# Altium schematic sheet MainDesign.SchDoc
size A2
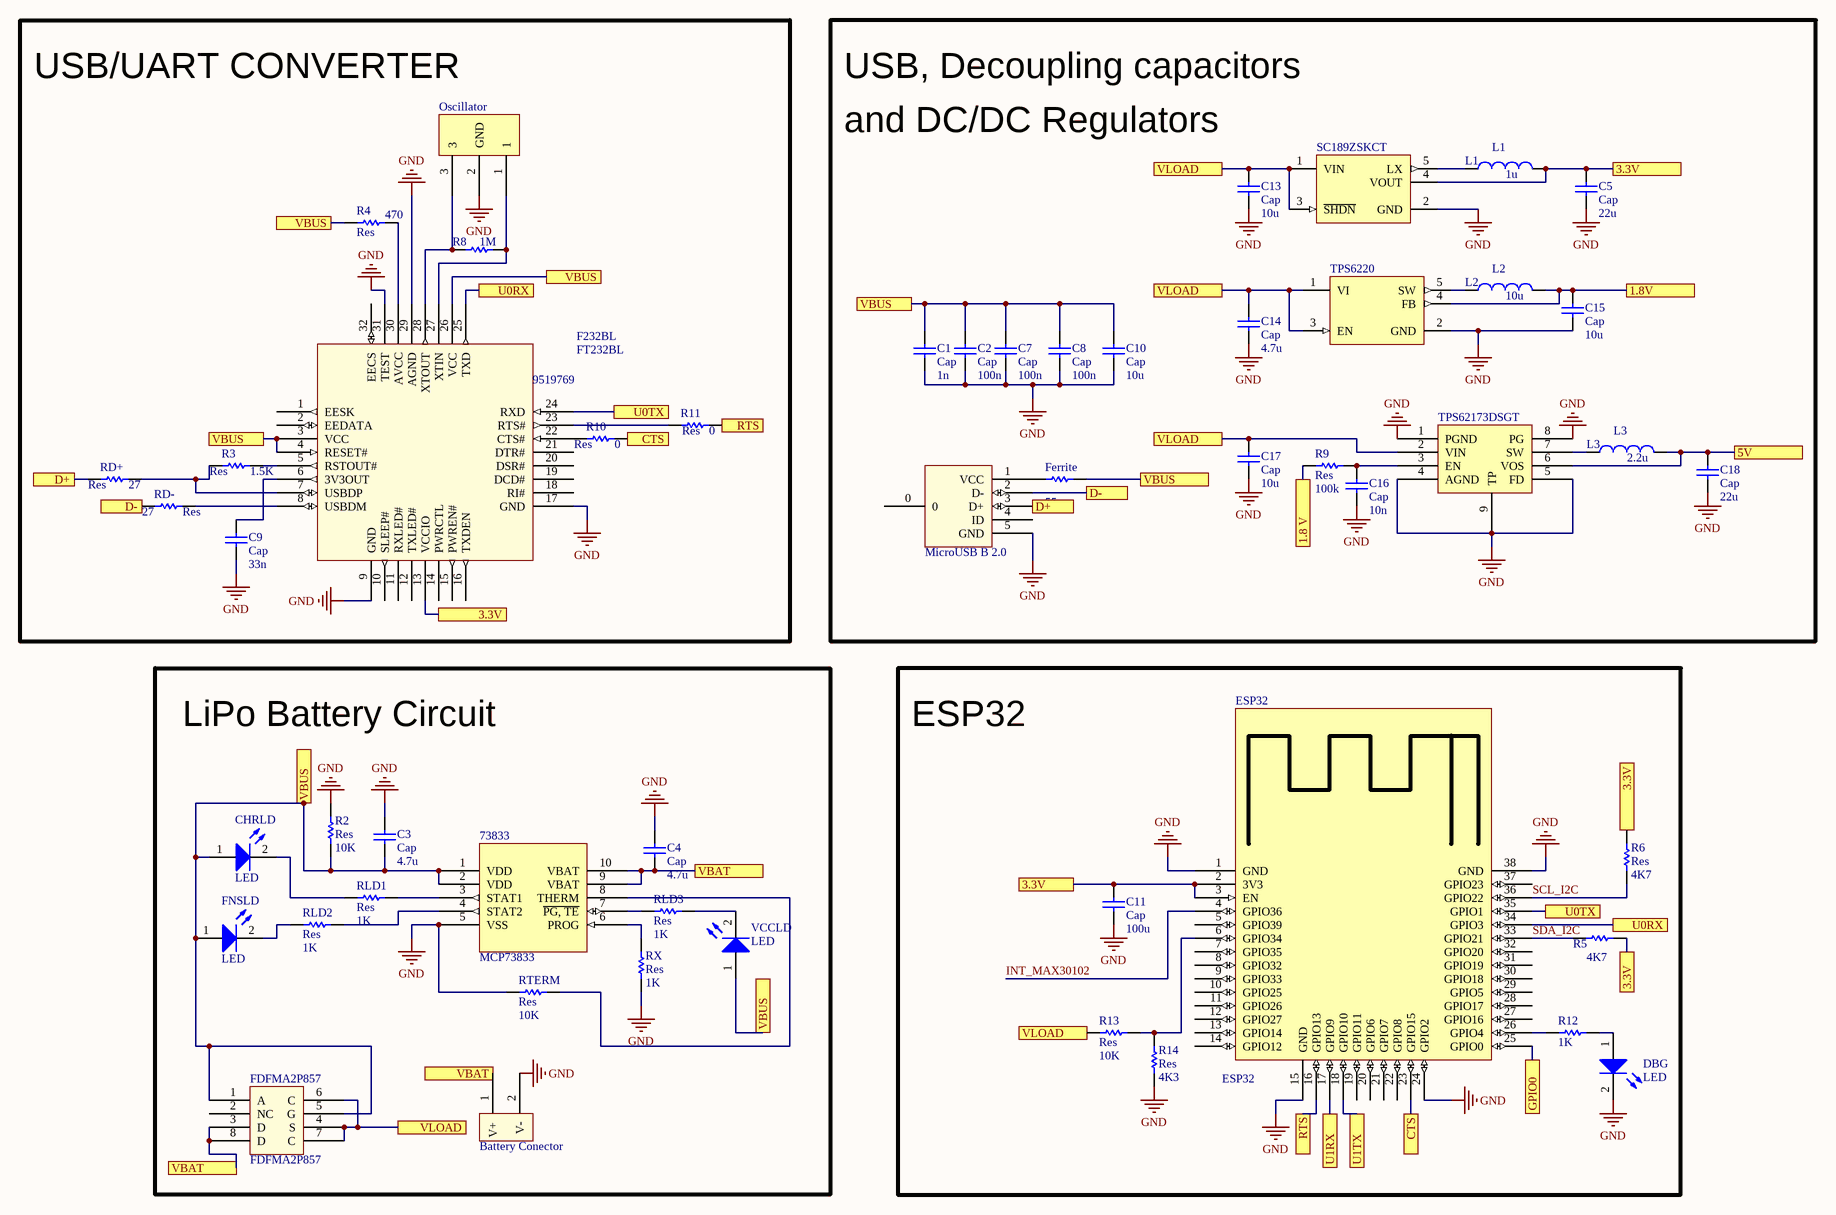
[diagram p0: MainDesign.SchDoc]

## Parts
73833  MCP73833  [MCP73833/4]
Battery_Conector  AMPHENOL 10114830 - Conector de Cable a Placa - 1.25mm  [AMPHENOL 10114830 - Conector de cable a placa - 1.25mm]  (value not drawn)
C1  Cap  value 1n  [0603 Cap]
C2  Cap  value 100n  [0603 Cap]
C3  Cap  value 4.7u  [0603 Cap]
C4  Cap  value 4.7u  [0603 Cap]
C5  Cap  value 22u  [0603 Cap]
C7  Cap  value 100n  [0603 Cap]
C8  Cap  value 100n  [0603 Cap]
C9  Cap  value 33n  [0603 Cap]
C10  Cap  value 10u  [0603 Cap]
C11  Cap  value 100u  [0603 Cap]
C13  Cap  value 10u  [0603 Cap]
C14  Cap  value 4.7u  [0603 Cap]
C15  Cap  value 10u  [0603 Cap]
C16  Cap  value 10n  [0603 Cap]
C17  Cap  value 10u  [0603 Cap]
C18  Cap  value 22u  [0603 Cap]
CHRLD  LED  [0603 LED-BLUE]
DBG  LED  [0603 LED-BLUE]
ESP32  ESP32  [ESP32]
F232BL  FT232BL  Supplier Part Number 1: 9519769  [FT232BQ2]
FDFMA2P857  FDFMA2P857  [FDFMA2P857]
Ferrite  value 55m  [0603 Res]  (hidden comment: Res)
FNSLD  LED  [0603 LED-BLUE]
L1  L1  value 1u  [0603 IND]
L2  L2  value 10u  [0603 IND]
L3  L3  value 2.2u  [0603 IND]
MicroUSB_B_2.0  MicroUSB B 2.0  [USB-MicroB]
Oscillator  CSTCRM600G55  [CSCTCR6M00G55B]  (value not drawn)
R2  Res  value 10K  [0603 Res]
R3  Res  value 1.5K  [0603 Res]
R4  Res  value 470  [0603 Res]
R5  value 4K7  [0603 Res]  (hidden comment: Res)
R6  Res  value 4K7  [0603 Res]
R8  value 1M  [0603 Res]  (hidden comment: Res)
R9  Res  value 100k  [0603 Res]
R10  Res  value 0  [0603 Res]
R11  Res  value 0  [0603 Res]
R12  value 1K  [0603 Res]  (hidden comment: Res)
R13  Res  value 10K  [0603 Res]
R14  Res  value 4K3  [0603 Res]
RD+  Res  value 27  [0603 Res]
RD-  Res  value 27  [0603 Res]
RLD1  Res  value 1K  [0603 Res]
RLD2  Res  value 1K  [0603 Res]
RLD3  Res  value 1K  [0603 Res]
RTERM  Res  value 10K  [0603 Res]
RX  Res  value 1K  [0603 Res]
SC189ZSKCT  SC189ZSKCT  [SOT23-5]  (value not drawn)
TPS6220  TPS6220  [SOT23-5]  (value not drawn)
TPS62173DSGT  TPS62173DSGT  [TPS62173DSGT]  (value not drawn)
VCCLD  LED  [0603 LED-BLUE]

## Blocks framed on the sheet
USB/UART CONVERTER: C9 F232BL Oscillator R3 R4 R8 R10 R11 RD+ RD-
LiPo Battery Circuit: 73833 Battery_Conector C3 C4 CHRLD FDFMA2P857 FNSLD R2 RLD1-RLD3 RTERM RX VCCLD
ESP32: C11 DBG ESP32 R5 R6 R12-R14

## Ports
1.8 V, 1.8V, 3.3V, 5V, CTS, D+, D-, GPIO0, RTS, U0RX, U0TX, U1RX, U1TX, VBAT, VBUS, VLOAD

## Nets
GND: 73833.5(VSS) Battery_Conector.2(V-) C1.1 C2.1 C3.2 C4.2 C5.1 C7.2 C8.1 C9.1 C10.2 C11.1 C13.1 C14.1 C15.1 C16.1 C17.2 C18.1 DBG.2(C) ESP32.1(GND) ESP32.15(GND) ESP32.24(GPIO2) ESP32.38(GND) F232BL.9(GND) F232BL.17(GND) F232BL.29(AGND) F232BL.31(TEST) MicroUSB_B_2.0.5(GND) Oscillator.2(GND) R2.2 R14.2 RTERM.1 RX.2 SC189ZSKCT.2(GND) TPS6220.2(GND) TPS62173DSGT.1(PGND) TPS62173DSGT.4(AGND) TPS62173DSGT.5(FD) TPS62173DSGT.8(PG) TPS62173DSGT.9(TP)
1.8 V: R9.2 ; port 1.8 V
1.8V: C15.2 L2.2 TPS6220.4(FB) ; port 1.8V
3.3V: C5.2 C11.2 ESP32.2(3V3) ESP32.3(EN) F232BL.13(VCCIO) L1.2 R5.1 R6.1 SC189ZSKCT.4(VOUT) ; port 3.3V
5V: C18.2 L3.2 TPS62173DSGT.6(VOS) ; port 5V
CTS: ESP32.23(GPIO15) R10.1 ; port CTS
D+: MicroUSB_B_2.0.3(D+) RD+.1 ; port D+
D-: MicroUSB_B_2.0.2(D-) RD-.1 ; port D-
GPIO0: ESP32.25(GPIO0) ; port GPIO0
INT_MAX30102: ESP32.4(GPIO36)
RTS: ESP32.16(GPIO13) R11.1 ; port RTS
SCL_I2C: ESP32.36(GPIO22) R6.2
SDA_I2C: ESP32.33(GPIO21) R5.2
U0RX: ESP32.34(GPIO3) F232BL.25(TXD) ; port U0RX
U0TX: ESP32.35(GPIO1) F232BL.24(RXD) ; port U0TX
U1RX: ESP32.17(GPIO9) ; port U1RX
U1TX: ESP32.18(GPIO10) ; port U1TX
VBAT: 73833.9(VBAT) 73833.10(VBAT) Battery_Conector.1(V+) C4.1 FDFMA2P857.3(D) FDFMA2P857.8(D) ; port VBAT
VBUS: 73833.1(VDD) 73833.2(VDD) C1.2 C2.2 C3.1 C7.1 C8.2 C10.1 CHRLD.1(A) F232BL.3(VCC) F232BL.4(RESET#) F232BL.26(VCC) FDFMA2P857.1(A) FDFMA2P857.5(G) Ferrite.2 FNSLD.1(A) R2.1 R4.1 VCCLD.1(A) ; port VBUS
VLOAD: C13.2 C14.2 C17.1 FDFMA2P857.4(S) FDFMA2P857.6(C) FDFMA2P857.7(C) R13.1 SC189ZSKCT.1(VIN) SC189ZSKCT.3(~{SHDN}) TPS6220.1(VI) TPS6220.3(EN) TPS62173DSGT.2(VIN) ; port VLOAD
Net73833_3: 73833.3(STAT1) RLD1.1
Net73833_4: 73833.4(STAT2) RLD2.1
Net73833_6: 73833.6(PROG) RX.1
Net73833_7: 73833.7(~{PG,_TE}) RLD3.2
Net73833_8: 73833.8(THERM) RTERM.2
NetC9_2: C9.2 F232BL.6(3V3OUT)
NetC16_2: C16.2 R9.1 TPS62173DSGT.3(EN)
NetCHRLD_2: CHRLD.2(C) RLD1.2
NetDBG_1: DBG.1(A) R12.2
NetESP32_6: ESP32.6(GPIO34) R13.2 R14.1
NetESP32_26: ESP32.26(GPIO4) R12.1
NetF232BL_5: F232BL.5(RSTOUT#) R3.2
NetF232BL_7: F232BL.7(USBDP) R3.1 RD+.2
NetF232BL_8: F232BL.8(USBDM) RD-.2
NetF232BL_22: F232BL.22(CTS#) R10.2
NetF232BL_23: F232BL.23(RTS#) R11.2
NetF232BL_27: F232BL.27(XTIN) Oscillator.1 R8.2
NetF232BL_28: F232BL.28(XTOUT) Oscillator.3 R8.1
NetF232BL_30: F232BL.30(AVCC) R4.2
NetFerrite_1: Ferrite.1 MicroUSB_B_2.0.1(VCC)
NetFNSLD_2: FNSLD.2(C) RLD2.2
NetL1_1: L1.1 SC189ZSKCT.5(LX)
NetL2_1: L2.1 TPS6220.5(SW)
NetL3_1: L3.1 TPS62173DSGT.7(SW)
NetRLD3_1: RLD3.1 VCCLD.2(C)

Not connected (* = marked no-connect by the designer): ESP32 5(GPIO39) 7(GPIO35) 8(GPIO32) 9(GPIO33) 10(GPIO25) 11(GPIO26) 12(GPIO27) 13(GPIO14) 14(GPIO12) 19(GPIO11) 20(GPIO6) 21(GPIO7) 22(GPIO8) 27(GPIO16) 28(GPIO17) 29(GPIO5) 30(GPIO18) 31(GPIO19) 32(GPIO20) 37(GPIO23); F232BL 1(EESK) 2(EEDATA) 10(SLEEP#) 11(RXLED#) 12(TXLED#) 14(PWRCTL) 15(PWREN#) 16(TXDEN) 18(RI#) 19(DCD#) 20(DSR#) 21(DTR#) 32(EECS); FDFMA2P857 2(NC); MicroUSB_B_2.0 0 4(ID)

## Notes on the sheet
- USB, Decoupling capacitors
- and DC/DC Regulators
- HELLO WORLD

## Library data of the parts
L1-L3 = Ind
SC189ZSKCT = MCP1603T-330I/OS: 500mA Synchronous Buck Regulator, 3.3V, 2.0 MHz, 5-Pin TSOT, Industrial Temperature, Tape and Reel; Published: 29-Jan-2009; DatasheetVersion: revA, May-2007; PackageVersion: revAW, Oct-2008; PackageReference: TSOT-OS5; Publisher: Altium Limited; PackageDescription: 5-Lead Plastic Small Outline Transistor (OS) [TSOT]; ComponentLink1Description: Manufacturer Link; ComponentLink1URL: http://www.microchip.com; ComponentLink2Description: Datasheet; ComponentLink2URL: http://ww1.microchip.com/downloads/en/DeviceDoc/22042a.pdf; ComponentLink3Description: Packaging Specification; ComponentLink3URL: http://ww1.microchip.com/downloads/en/PackagingSpec/00049AW.pdf
73833 = MCP73833: Supplier 1: Digi-Key; Supplier Part Number 1: MCP73833T-AMI/UNCT-ND
Battery_Conector = AMPHENOL 10114830 - Conector de Cable a Placa - 1.25mm: Supplier 1: Farnell; Supplier Part Number 1: 2100756
F232BL = FT232BL: Supplier 1: Farnell
FDFMA2P857 = FDFMA2P857: Supplier 1: Digi-Key; Supplier Part Number 1: FDFMA2P857CT-ND
Oscillator = CSTCRM600G55: Supplier 1: Digi-Key; Supplier Part Number 1: 490-5997-2-ND
TPS6220 = TPS6220: Published: 29-Jan-2009; DatasheetVersion: revA, May-2007; PackageVersion: revAW, Oct-2008; PackageReference: TSOT-OS5; Publisher: Altium Limited; PackageDescription: 5-Lead Plastic Small Outline Transistor (OS) [TSOT]; ComponentLink1Description: Manufacturer Link; ComponentLink1URL: http://www.microchip.com; ComponentLink2Description: Datasheet; ComponentLink2URL: http://ww1.microchip.com/downloads/en/DeviceDoc/22042a.pdf; ComponentLink3Description: Packaging Specification; ComponentLink3URL: http://ww1.microchip.com/downloads/en/PackagingSpec/00049AW.pdf
TPS62173DSGT = TPS62173DSGT: Published: 29-Jan-2009; DatasheetVersion: revA, May-2007; PackageVersion: revAW, Oct-2008; PackageReference: TSOT-OS5; Publisher: Altium Limited; PackageDescription: 5-Lead Plastic Small Outline Transistor (OS) [TSOT]; ComponentLink1Description: Manufacturer Link; ComponentLink1URL: http://www.microchip.com; ComponentLink2Description: Datasheet; ComponentLink2URL: http://ww1.microchip.com/downloads/en/DeviceDoc/22042a.pdf; ComponentLink3Description: Packaging Specification; ComponentLink3URL: http://ww1.microchip.com/downloads/en/PackagingSpec/00049AW.pdf